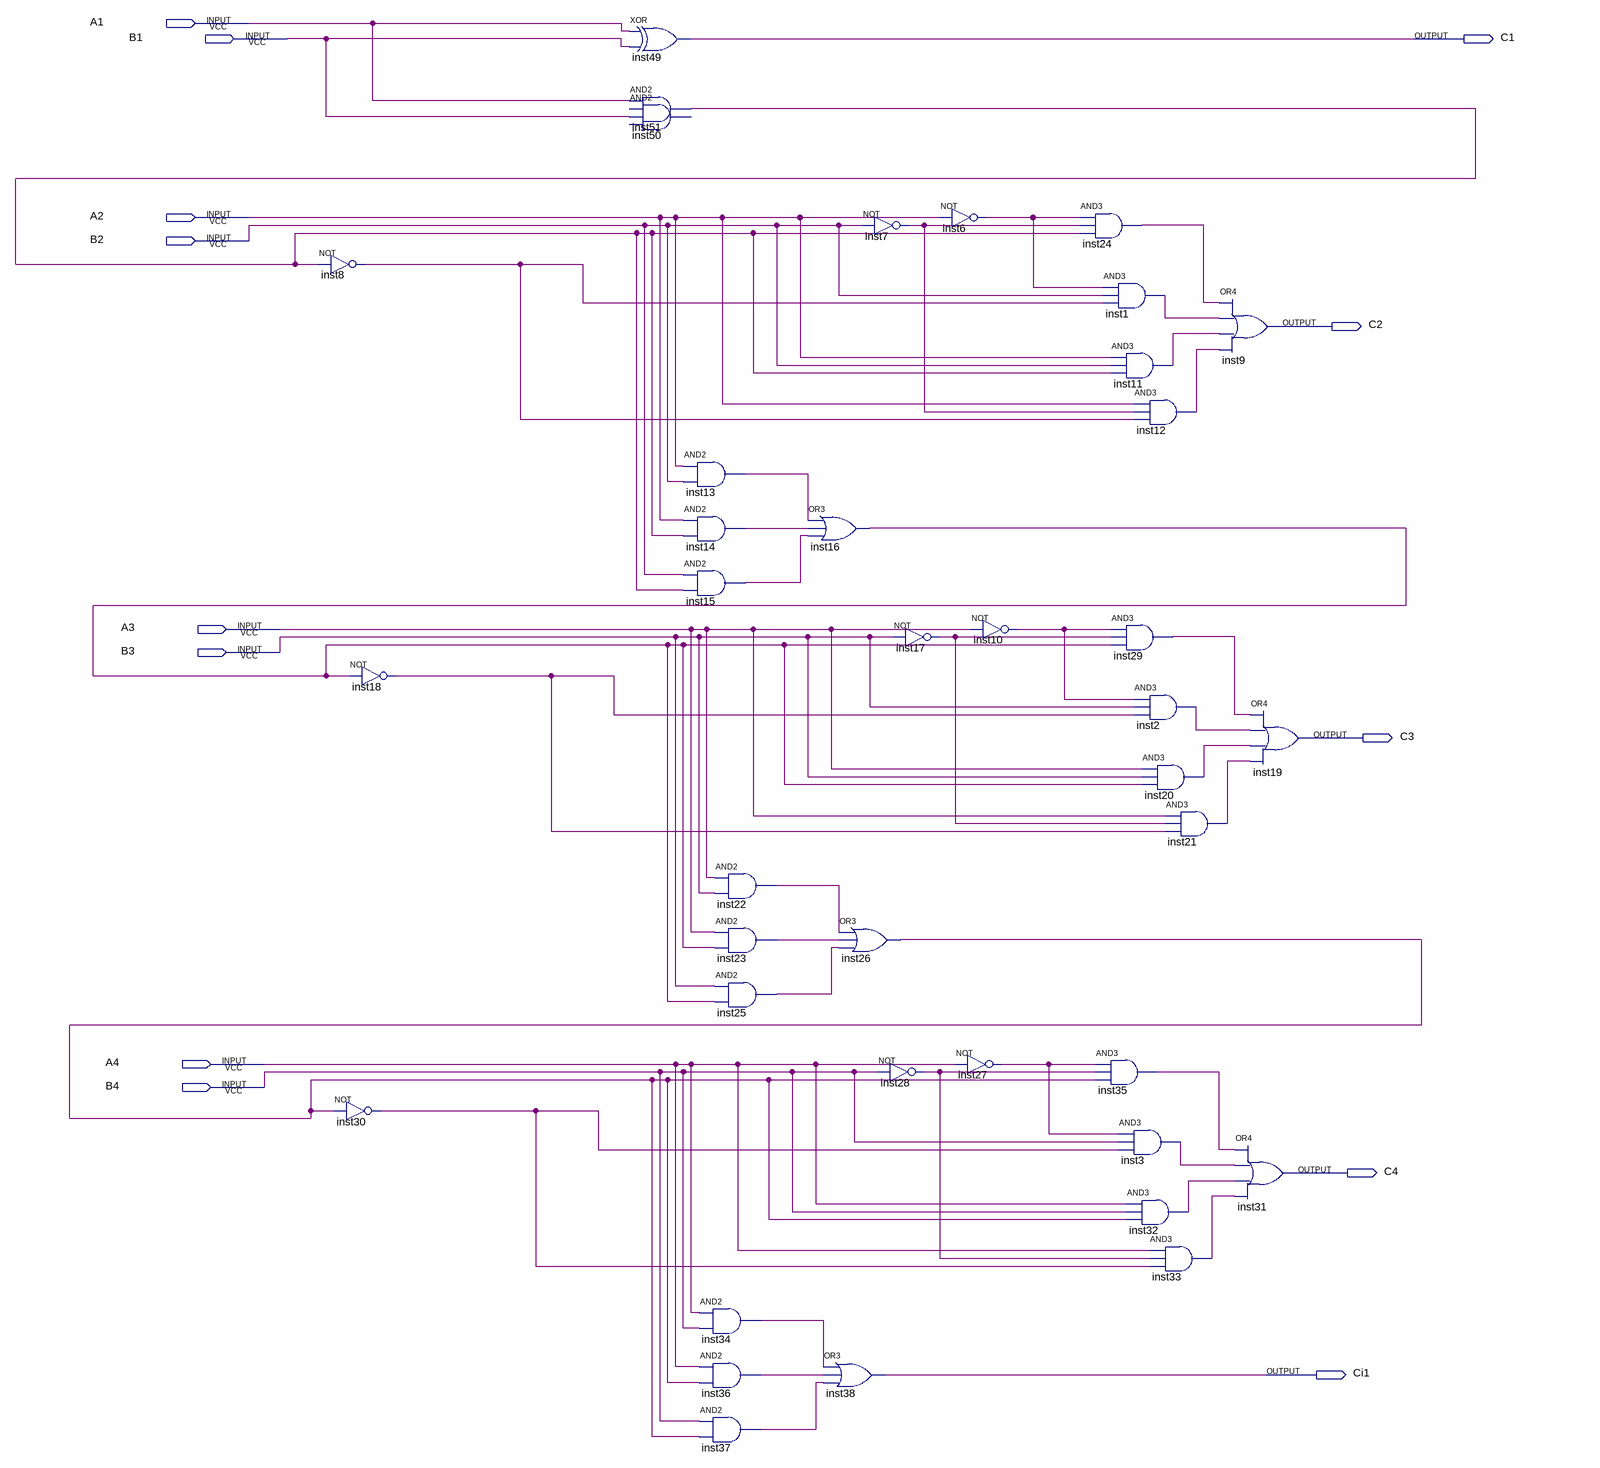
[diagram p0: schematic sheet]
// Quartus schematic fullAdder.bdf as structural Verilog: 39 symbols, 13 pins
module fullAdder (
  input  A1,
  input  B1,
  input  A2,
  input  B2,
  input  A3,
  input  B3,
  input  A4,
  input  B4,
  output C1,
  output C2,
  output C3,
  output C4,
  output Ci1
);

  wire inst1_out, inst2_out, inst3_out, inst6_out, inst7_out, inst8_out, inst10_out, inst11_out, inst12_out,
       inst13_out, inst14_out, inst15_out, inst16_out, inst17_out, inst18_out, inst20_out, inst21_out,
       inst22_out, inst23_out, inst24_out, inst25_out, inst26_out, inst27_out, inst28_out, inst29_out,
       inst30_out, inst32_out, inst33_out, inst34_out, inst35_out, inst36_out, inst37_out, inst51_out;

  not inst8 (inst8_out, inst51_out);
  not inst18 (inst18_out, inst16_out);
  not inst30 (inst30_out, inst26_out);
  xor inst49 (C1, A1, B1);
  and inst51 (inst51_out, A1, B1);
  // AND2 inst50 is placed but not wired
  and inst13 (inst13_out, A2, B2);
  and inst14 (inst14_out, A2, inst51_out);
  and inst15 (inst15_out, B2, inst51_out);
  and inst22 (inst22_out, A3, B3);
  and inst23 (inst23_out, A3, inst16_out);
  and inst25 (inst25_out, B3, inst16_out);
  and inst34 (inst34_out, A4, B4);
  and inst36 (inst36_out, A4, inst26_out);
  and inst37 (inst37_out, B4, inst26_out);
  or inst16 (inst16_out, inst13_out, inst14_out, inst15_out);
  or inst26 (inst26_out, inst22_out, inst23_out, inst25_out);
  or inst38 (Ci1, inst34_out, inst36_out, inst37_out);
  not inst7 (inst7_out, B2);
  not inst17 (inst17_out, B3);
  not inst28 (inst28_out, B4);
  not inst6 (inst6_out, A2);
  not inst10 (inst10_out, A3);
  not inst27 (inst27_out, A4);
  and inst24 (inst24_out, inst6_out, inst7_out, inst51_out);
  and inst1 (inst1_out, inst6_out, B2, inst8_out);
  and inst35 (inst35_out, inst27_out, inst28_out, inst26_out);
  and inst11 (inst11_out, A2, B2, inst51_out);
  and inst12 (inst12_out, A2, inst7_out, inst8_out);
  and inst29 (inst29_out, inst10_out, inst17_out, inst16_out);
  and inst2 (inst2_out, inst10_out, B3, inst18_out);
  and inst20 (inst20_out, A3, B3, inst16_out);
  and inst21 (inst21_out, A3, inst17_out, inst18_out);
  and inst3 (inst3_out, inst27_out, B4, inst30_out);
  and inst32 (inst32_out, A4, B4, inst26_out);
  and inst33 (inst33_out, A4, inst28_out, inst30_out);
  or inst9 (C2, inst24_out, inst1_out, inst11_out, inst12_out);
  or inst19 (C3, inst29_out, inst2_out, inst20_out, inst21_out);
  or inst31 (C4, inst35_out, inst3_out, inst32_out, inst33_out);
endmodule
